# Altium schematic sheet G-SENSOR.SchDoc
size A4
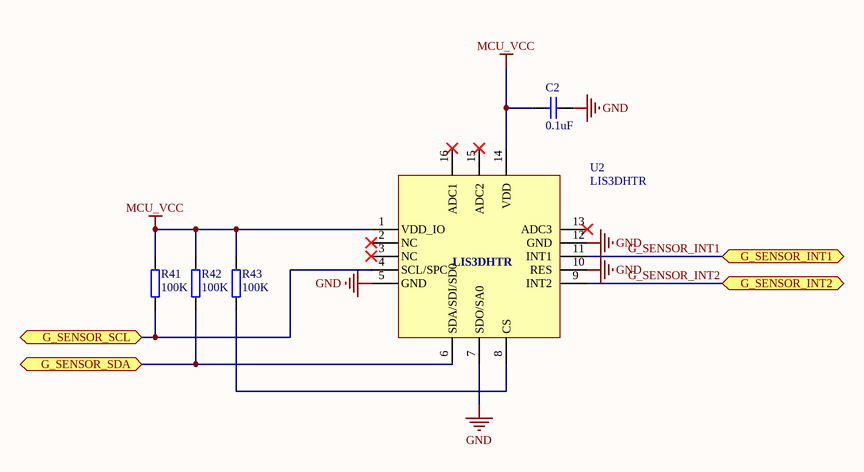
[diagram p0: G-SENSOR.SchDoc]

## Parts
C2  0.1uF  [0603C]
R41  100K  [0603R]
R42  100K  [0603R]
R43  100K  [0603R]
U2  LIS3DHTR  [LC-LGA-16_3x3mm]

## Ports
G_SENSOR_INT1, G_SENSOR_INT2, G_SENSOR_SCL, G_SENSOR_SDA

## Nets
GND: C2.1 U2.5(GND) U2.7(SDO/SA0) U2.10(RES) U2.12(GND)
MCU_VCC: C2.2 R41.1 R42.1 R43.1 U2.1(VDD_IO) U2.14(VDD)
G_SENSOR_INT1: U2.11(INT1) ; port G_SENSOR_INT1
G_SENSOR_INT2: U2.9(INT2) ; port G_SENSOR_INT2
G_SENSOR_SCL: R41.2 U2.4(SCL/SPC) ; port G_SENSOR_SCL
G_SENSOR_SDA: R42.2 U2.6(SDA/SDI/SD0) ; port G_SENSOR_SDA
NetR43_2: R43.2 U2.8(CS)

Not connected (* = marked no-connect by the designer): U2 2(NC)* 3(NC)* 13(ADC3)* 15(ADC2)* 16(ADC1)*

## Library data of the parts
C2 = Cap: Capacitor; Value: 104; Published: 8-Jun-2000; LatestRevisionDate: 17-Jul-2002; LatestRevisionNote: Re-released for DXP Platform.; Publisher: Altium Limited
R41-R43 = RES2A